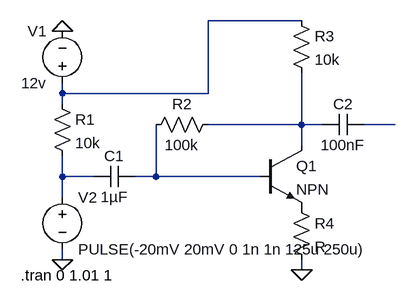
[diagram p0: schematic Microphone_Driver_Real.asc]
Microphone_Driver_Real.asc, the LTspice schematic file:
Version 4
SHEET 1 880 680
WIRE 480 -16 336 -16
WIRE 112 96 112 80
WIRE 336 96 336 -16
WIRE 336 96 112 96
WIRE 112 112 112 96
WIRE 480 144 480 64
WIRE 480 144 336 144
WIRE 512 144 480 144
WIRE 624 144 576 144
WIRE 480 176 480 144
WIRE 112 224 112 192
WIRE 160 224 112 224
WIRE 256 224 256 144
WIRE 256 224 224 224
WIRE 416 224 256 224
WIRE 112 256 112 224
WIRE 112 352 112 336
WIRE 480 368 480 352
FLAG 112 352 0
FLAG 112 0 0
FLAG 480 368 0
SYMBOL res 96 96 R0
SYMATTR InstName R1
SYMATTR Value 10k
SYMBOL cap 224 208 R90
WINDOW 0 0 32 VBottom 2
WINDOW 3 32 32 VTop 2
SYMATTR InstName C1
SYMATTR Value 1µF
SYMBOL voltage 112 96 R180
WINDOW 0 24 96 Left 2
WINDOW 3 24 16 Left 2
WINDOW 123 0 0 Left 2
WINDOW 39 0 0 Left 2
SYMATTR InstName V1
SYMATTR Value 12v
SYMBOL voltage 112 240 R0
WINDOW 123 0 0 Left 2
WINDOW 39 0 0 Left 2
SYMATTR InstName V2
SYMATTR Value PULSE(-20mV 20mV 0 1n 1n 125u 250u)
SYMBOL res 352 128 R90
WINDOW 0 0 56 VBottom 2
WINDOW 3 32 56 VTop 2
SYMATTR InstName R2
SYMATTR Value 100k
SYMBOL npn 416 176 R0
SYMATTR InstName Q1
SYMBOL res 464 -32 R0
SYMATTR InstName R3
SYMATTR Value 10k
SYMBOL cap 576 128 R90
WINDOW 0 0 32 VBottom 2
WINDOW 3 32 32 VTop 2
SYMATTR InstName C2
SYMATTR Value 100nF
SYMBOL res 464 256 R0
SYMATTR InstName R4
TEXT 48 376 Left 2 !.tran 0 1.01 1

The netlist it stands for:
* Microphone_Driver_Real.asc
R1 N001 N004 10k
C1 N005 N004 1µF
V1 N001 0 12v
V2 N004 0 PULSE(-20mV 20mV 0 1n 1n 125u 250u)
R2 N002 N005 100k
Q1 N002 N005 P001 0 NPN
R3 N001 N002 10k
C2 N003 N002 100nF
R4 P001 0 R
.model NPN NPN
.model PNP PNP
.lib standard.bjt
.tran 0 1.01 1
.backanno
.end